# EAGLE design mixer (EAGLE 7.2.0)

## Sheet 1 of 4: IF Filter
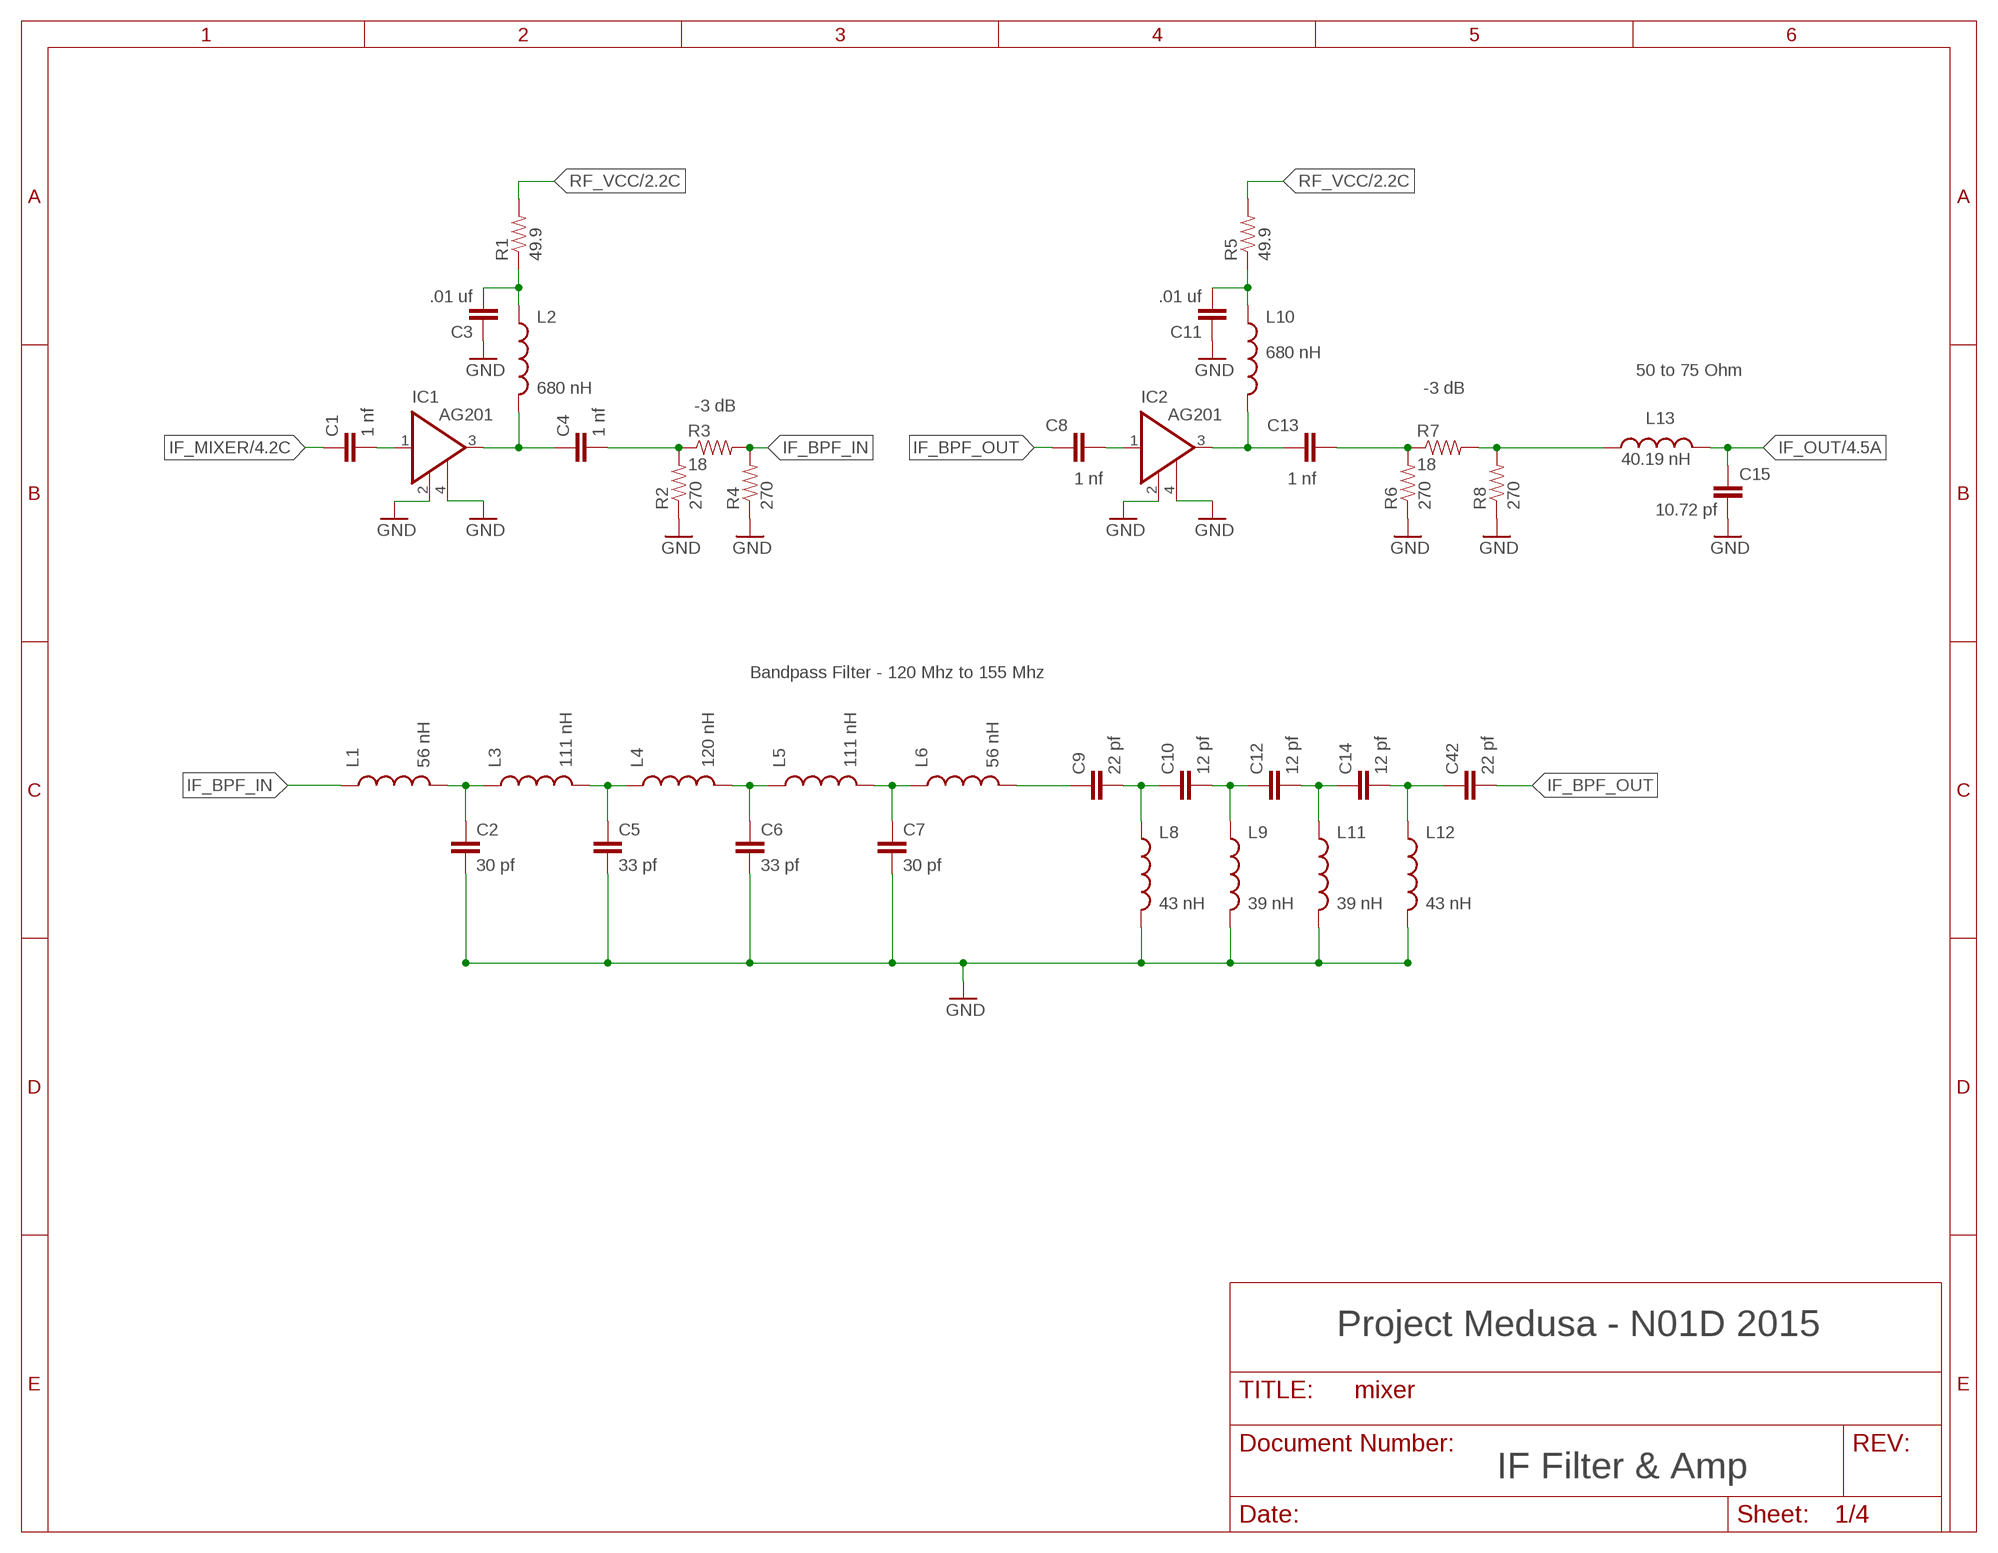
[diagram p0: schematic, sheet 1]

### Parts
C1  1 nf  CAP0805  [0805]
C2  30 pf  CAP0805  [0805]
C3  .01 uf  CAP0805  [0805]
C4  1 nf  CAP0805  [0805]
C5  33 pf  CAP0805  [0805]
C6  33 pf  CAP0805  [0805]
C7  30 pf  CAP0805  [0805]
C8  1 nf  CAP0805  [0805]
C9  22 pf  CAP0805  [0805]
C10  12 pf  CAP0805  [0805]
C11  .01 uf  CAP0805  [0805]
C12  12 pf  CAP0805  [0805]
C13  1 nf  CAP0805  [0805]
C14  12 pf  CAP0805  [0805]
C15  10.72 pf  CAP0805  [0805]
C42  22 pf  CAP0805  [0805]
IC1  AG201  ERA-6SM  [WW]
IC2  AG201  ERA-6SM  [WW]
L1  56 nH  INDUCTORCOILCRAFT-318-2  [318-2]
L2  680 nH  INDUCTOR0805  [0805]
L3  111 nH  INDUCTORCOILCRAFT-319-2  [319-2]
L4  120 nH  INDUCTORCOILCRAFT-318-2  [318-2]
L5  111 nH  INDUCTORCOILCRAFT-319-2  [319-2]
L6  56 nH  INDUCTORCOILCRAFT-318-2  [318-2]
L8  43 nH  INDUCTORCOILCRAFT-457-43NH  [457-43]
L9  39 nH  INDUCTORCOILCRAFT-457-39NH  [457-39]
L10  680 nH  INDUCTOR0805  [0805]
L11  39 nH  INDUCTORCOILCRAFT-457-39NH  [457-39]
L12  43 nH  INDUCTORCOILCRAFT-457-43NH  [457-43]
L13  40.19 nH  INDUCTOR0402  [C0402]
R1  49.9  RESISTOR0805-RES  [0805]
R2  270  RESISTOR1206  [1206]
R3  18  RESISTOR1206  [1206]
R4  270  RESISTOR1206  [1206]
R5  49.9  RESISTOR0805-RES  [0805]
R6  270  RESISTOR1206  [1206]
R7  18  RESISTOR1206  [1206]
R8  270  RESISTOR1206  [1206]

### Nets
GND: C2.2 C3.1 C5.2 C6.2 C7.2 C11.1 C15.1 IC1.2(GND) IC1.4(GND) IC2.2(GND) IC2.4(GND) L8.P$2 L9.P$2 L11.P$2 L12.P$2 R2.1 R4.1 R6.1 R8.1 ; also sheet 2,3,4
IF_BPF_IN: L1.P$1 R3.2 R4.2
IF_BPF_OUT: C8.1 C42.2
IF_MIXER: C1.1 ; also sheet 4
IF_OUT: C15.2 L13.2 ; also sheet 4
N$1: C2.1 L1.P$2 L3.P$1
N$2: C5.1 L3.P$2 L4.P$1
N$3: C6.1 L4.P$2 L5.P$1
N$4: C7.1 L5.P$2 L6.P$1
N$5: C9.1 L6.P$2
N$6: C9.2 C10.1 L8.P$1
N$7: C10.2 C12.1 L9.P$1
N$8: C12.2 C14.1 L11.P$1
N$9: C1.2 IC1.1(RFIN)
N$10: C4.1 IC1.3(RFOUT/DCIN) L2.2
N$11: C3.2 L2.1 R1.1
N$12: C4.2 R2.2 R3.1
N$14: C8.2 IC2.1(RFIN)
N$15: C13.1 IC2.3(RFOUT/DCIN) L10.2
N$16: C11.2 L10.1 R5.1
N$17: C13.2 R6.2 R7.1
N$18: L13.1 R7.2 R8.2
N$49: C14.2 C42.1 L12.P$1
RF_VCC: R1.2 R5.2 ; also sheet 2,3,4

### Notes on the sheet
- 50 to 75 Ohm
- -3 dB
- -3 dB
- Bandpass Filter - 120 Mhz to 155 Mhz
- Project Medusa - N01D 2015
- IF Filter & Amp

## Sheet 2 of 4: RF Filter
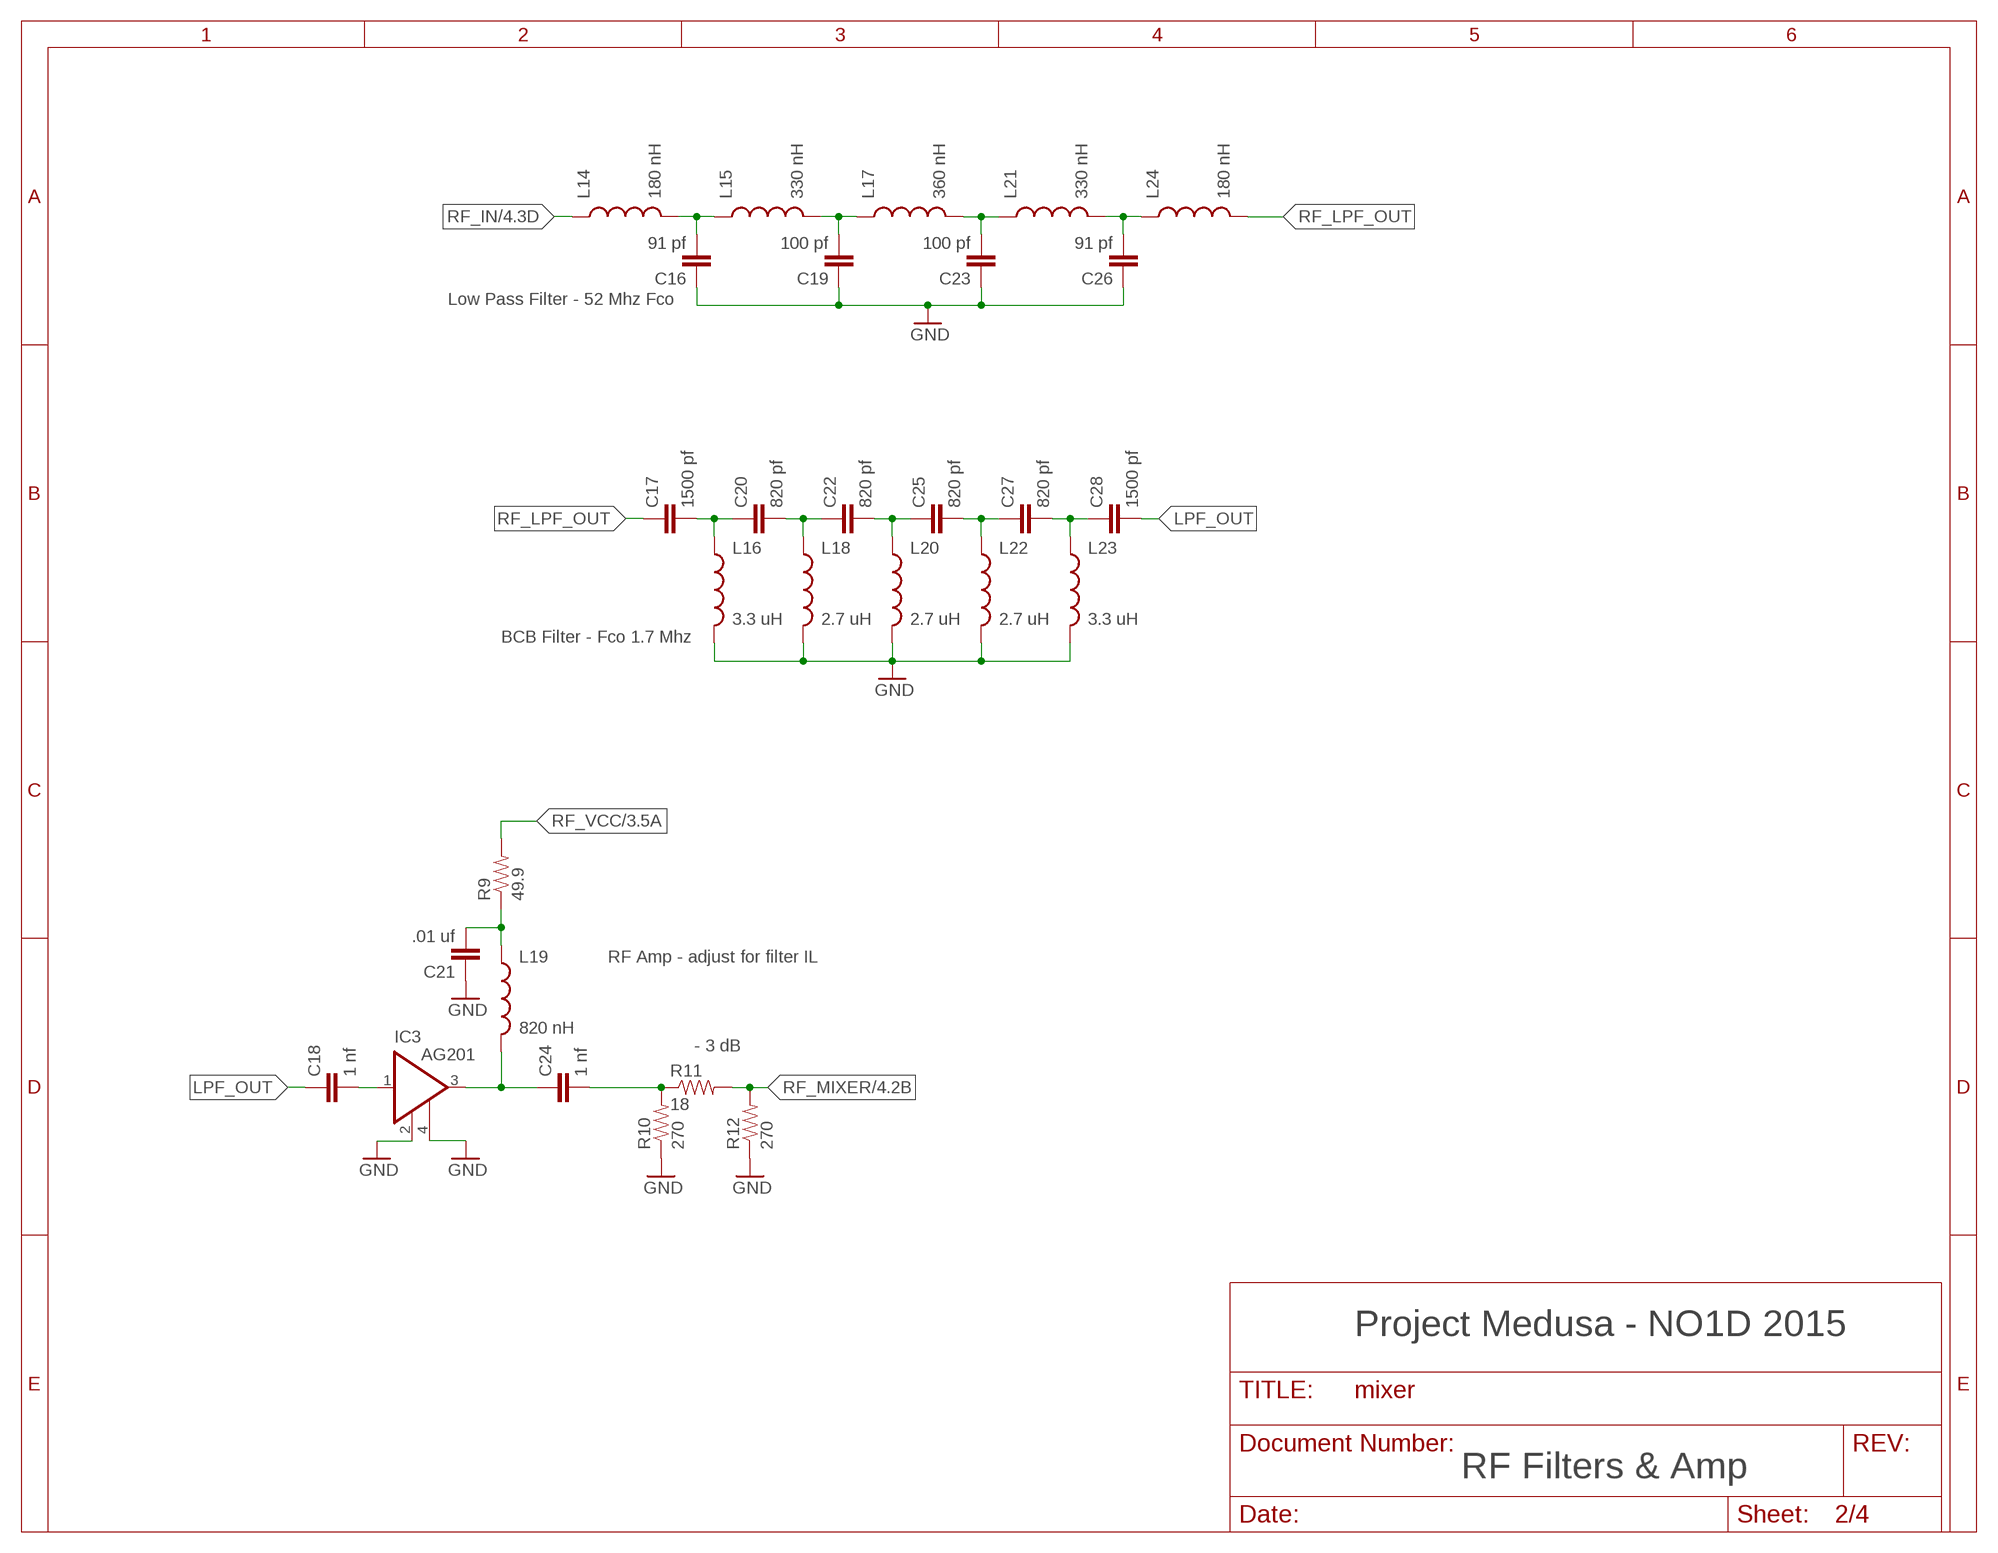
[diagram p1: schematic, sheet 2]

### Parts
C16  91 pf  CAP0805  [0805]
C17  1500 pf  CAP0805  [0805]
C18  1 nf  CAP0805  [0805]
C19  100 pf  CAP0805  [0805]
C20  820 pf  CAP0805  [0805]
C21  .01 uf  CAP0805  [0805]
C22  820 pf  CAP0805  [0805]
C23  100 pf  CAP0805  [0805]
C24  1 nf  CAP0805  [0805]
C25  820 pf  CAP0805  [0805]
C26  91 pf  CAP0805  [0805]
C27  820 pf  CAP0805  [0805]
C28  1500 pf  CAP0805  [0805]
IC3  AG201  ERA-6SM  [WW]
L14  180 nH  INDUCTORCOILCRAFT-438-2-180  [438-2-180]
L15  330 nH  INDUCTORCOILCRAFT-438-2-330  [438-2-330]
L16  3.3 uH  INDUCTORRLB0912  [RLB0912]
L17  360 nH  INDUCTORCOILCRAFT-438-2-360  [438-2-360]
L18  2.7 uH  INDUCTORRLB0912  [RLB0912]
L19  820 nH  INDUCTOR0805  [0805]
L20  2.7 uH  INDUCTORRLB0912  [RLB0912]
L21  330 nH  INDUCTORCOILCRAFT-438-2-330  [438-2-330]
L22  2.7 uH  INDUCTORRLB0912  [RLB0912]
L23  3.3 uH  INDUCTORRLB0912  [RLB0912]
L24  180 nH  INDUCTORCOILCRAFT-438-2-180  [438-2-180]
R9  49.9  RESISTOR0805-RES  [0805]
R10  270  RESISTOR1206  [1206]
R11  18  RESISTOR1206  [1206]
R12  270  RESISTOR1206  [1206]

### Nets
GND: C16.1 C19.1 C21.1 C23.1 C26.1 IC3.2(GND) IC3.4(GND) L16.2 L18.2 L20.2 L22.2 L23.2 R10.1 R12.1 ; also sheet 1,3,4
LPF_OUT: C18.1 C28.2
N$13: C18.2 IC3.1(RFIN)
N$19: C24.1 IC3.3(RFOUT/DCIN) L19.2
N$20: C21.2 L19.1 R9.1
N$21: C24.2 R10.2 R11.1
N$23: C16.2 L14.P$2 L15.P$1
N$24: C19.2 L15.P$2 L17.P$1
N$25: C23.2 L17.P$2 L21.P$1
N$26: C26.2 L21.P$2 L24.P$1
N$28: C17.2 C20.1 L16.1
N$29: C20.2 C22.1 L18.1
N$30: C22.2 C25.1 L20.1
N$31: C25.2 C27.1 L22.1
N$32: C27.2 C28.1 L23.1
RF_IN: L14.P$1 ; also sheet 4
RF_LPF_OUT: C17.1 L24.P$2
RF_MIXER: R11.2 R12.2 ; also sheet 4
RF_VCC: R9.2 ; also sheet 1,3,4

### Notes on the sheet
- Low Pass Filter - 52 Mhz Fco
- BCB Filter - Fco 1.7 Mhz
- RF Amp - adjust for filter IL
- - 3 dB
- Project Medusa - NO1D 2015
- RF Filters & Amp

## Sheet 3 of 4: LO Filter
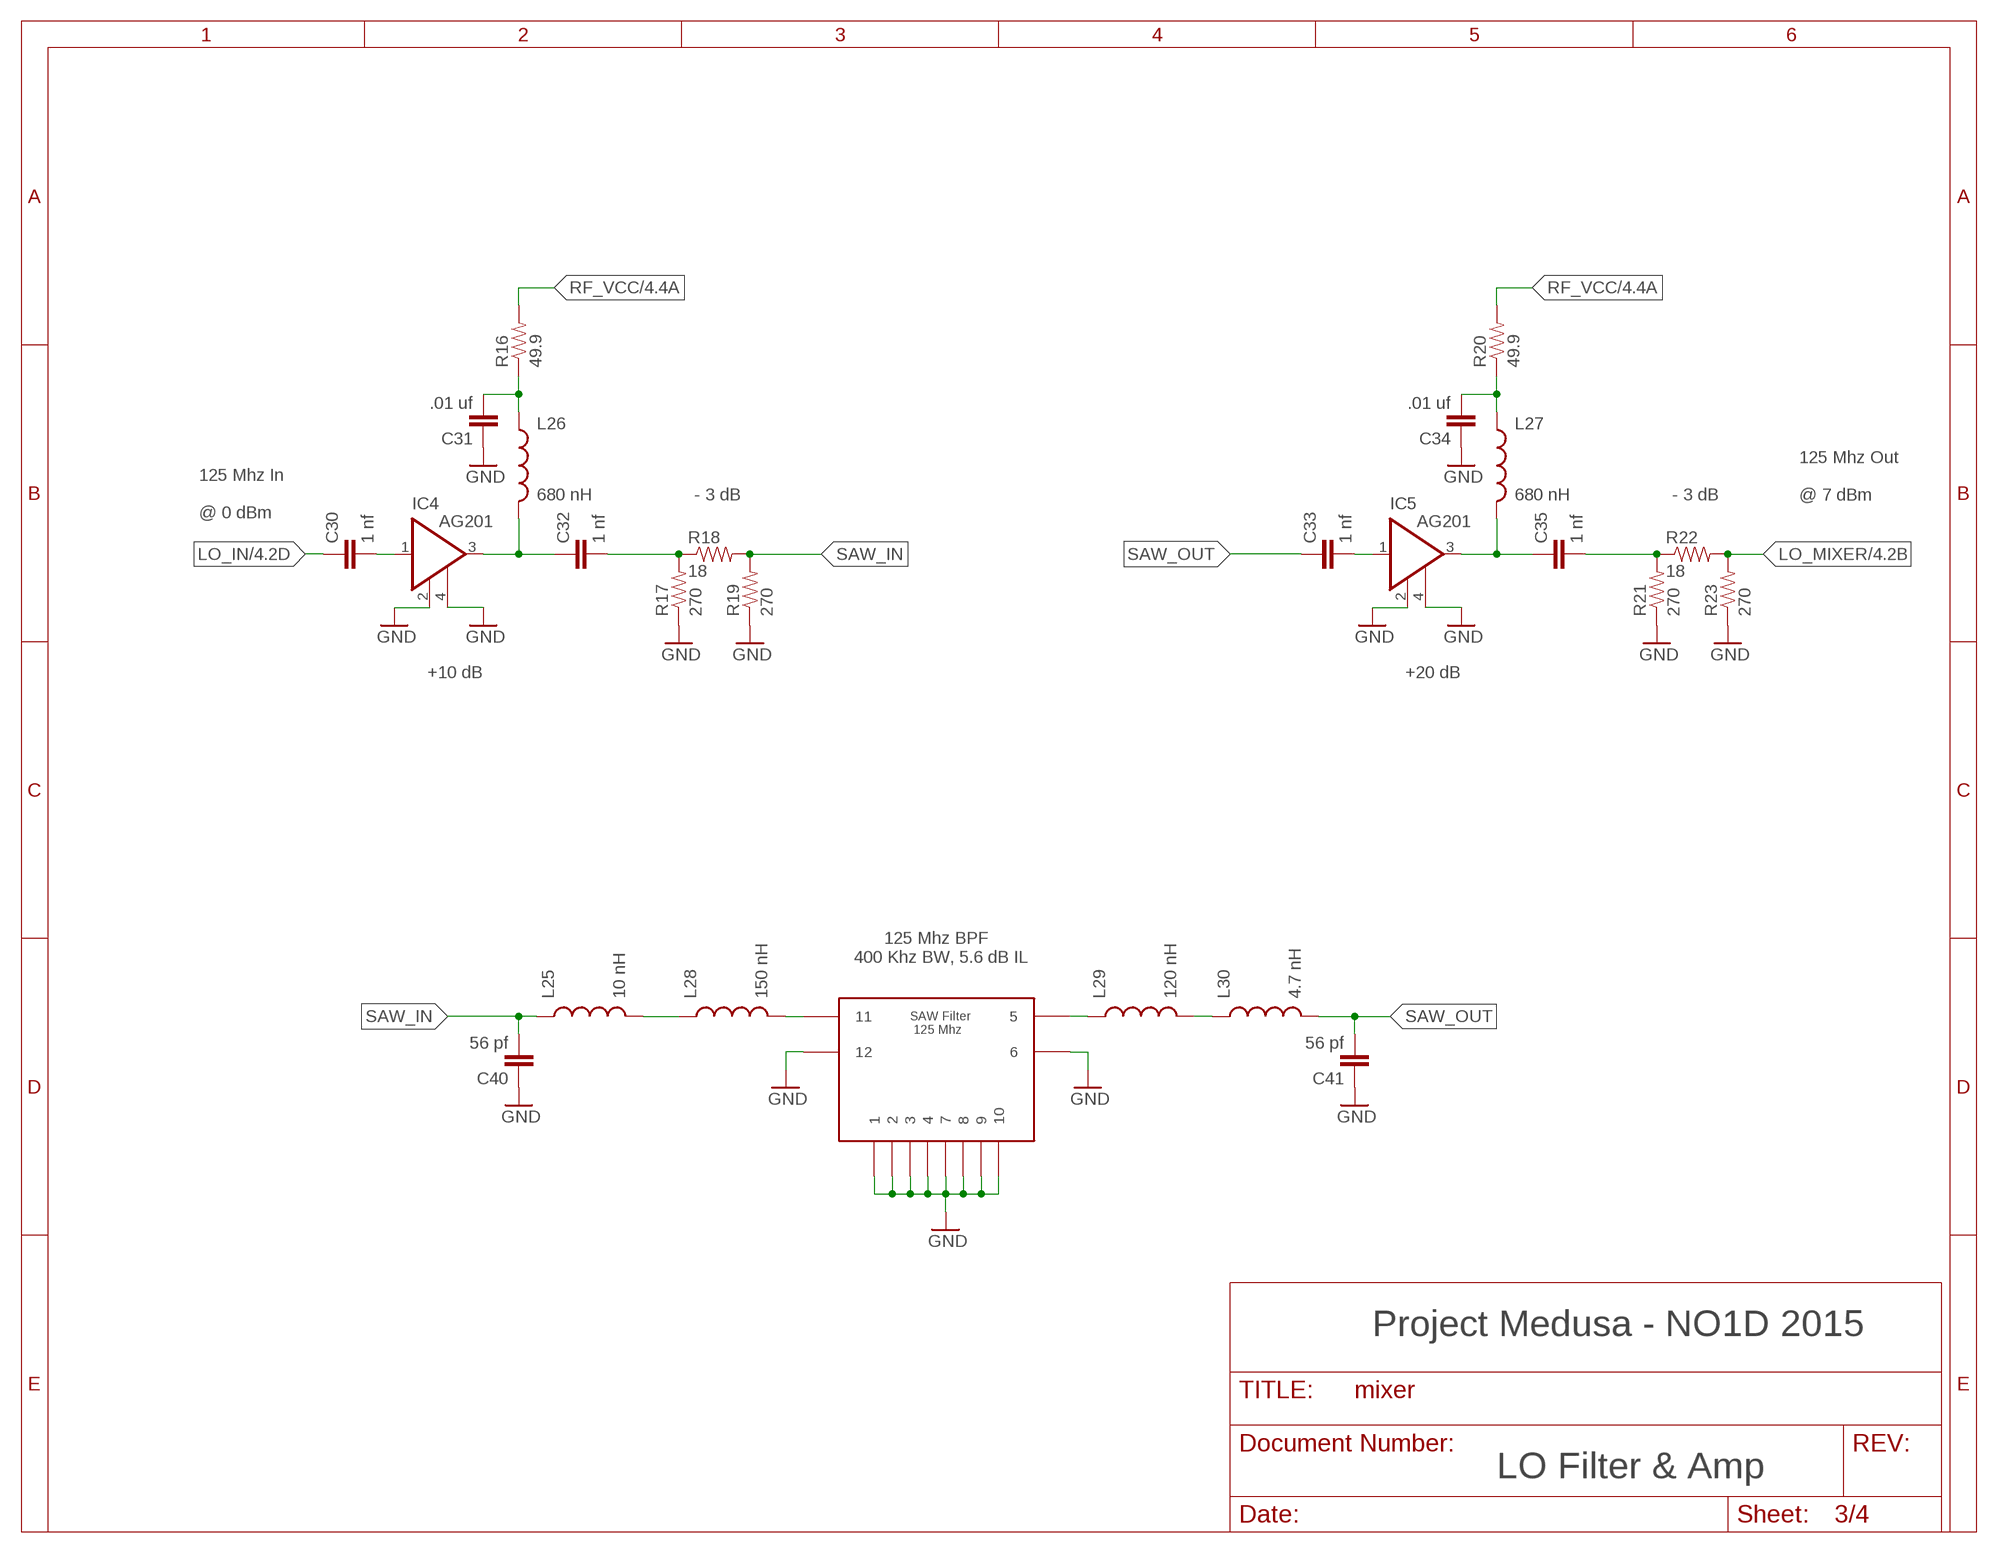
[diagram p2: schematic, sheet 3]

### Parts
C30  1 nf  CAP0805  [0805]
C31  .01 uf  CAP0805  [0805]
C32  1 nf  CAP0805  [0805]
C33  1 nf  CAP0805  [0805]
C34  .01 uf  CAP0805  [0805]
C35  1 nf  CAP0805  [0805]
C40  56 pf  CAP0805  [0805]
C41  56 pf  CAP0805  [0805]
IC4  AG201  ERA-6SM  [WW]
IC5  AG201  ERA-6SM  [WW]
L25  10 nH  INDUCTOR0402  [C0402]
L26  680 nH  INDUCTOR0805  [0805]
L27  680 nH  INDUCTOR0805  [0805]
L28  150 nH  INDUCTOR0805  [0805]
L29  120 nH  INDUCTOR0805  [0805]
L30  4.7 nH  INDUCTOR0402  [C0402]
R16  49.9  RESISTOR0805-RES  [0805]
R17  270  RESISTOR1206  [1206]
R18  18  RESISTOR1206  [1206]
R19  270  RESISTOR1206  [1206]
R20  49.9  RESISTOR0805-RES  [0805]
R21  270  RESISTOR1206  [1206]
R22  18  RESISTOR1206  [1206]
R23  270  RESISTOR1206  [1206]
SAW1  SAW-125MHZ  [SAW-125M-SMP]

### Nets
GND: C31.1 C34.1 C40.1 C41.1 IC4.2(GND) IC4.4(GND) IC5.2(GND) IC5.4(GND) R17.1 R19.1 R21.1 R23.1 SAW1.P$1 SAW1.P$2 SAW1.P$3 SAW1.P$4 SAW1.P$6 SAW1.P$7 SAW1.P$8 SAW1.P$9 SAW1.P$10 SAW1.P$12 ; also sheet 1,2,4
LO_IN: C30.1 ; also sheet 4
LO_MIXER: R22.2 R23.2 ; also sheet 4
N$22: C30.2 IC4.1(RFIN)
N$33: C32.1 IC4.3(RFOUT/DCIN) L26.2
N$34: C31.2 L26.1 R16.1
N$35: C32.2 R17.2 R18.1
N$36: C33.2 IC5.1(RFIN)
N$37: C35.1 IC5.3(RFOUT/DCIN) L27.2
N$38: C34.2 L27.1 R20.1
N$39: C35.2 R21.2 R22.1
N$45: L25.2 L28.1
N$46: L29.2 L30.1
N$47: L28.2 SAW1.P$11
N$48: L29.1 SAW1.P$5
RF_VCC: R16.2 R20.2 ; also sheet 1,2,4
SAW_IN: C40.2 L25.1 R18.2 R19.2
SAW_OUT: C33.1 C41.2 L30.2

### Notes on the sheet
- - 3 dB | - 3 dB
- 125 Mhz Out
  
  @ 7 dBm
- 125 Mhz In
  
  @ 0 dBm
- +10 dB | +20 dB
- 125 Mhz BPF 
     400 Khz BW, 5.6 dB IL
- Project Medusa - NO1D 2015
- LO Filter & Amp

## Sheet 4 of 4: Mixer, Power, Connectors
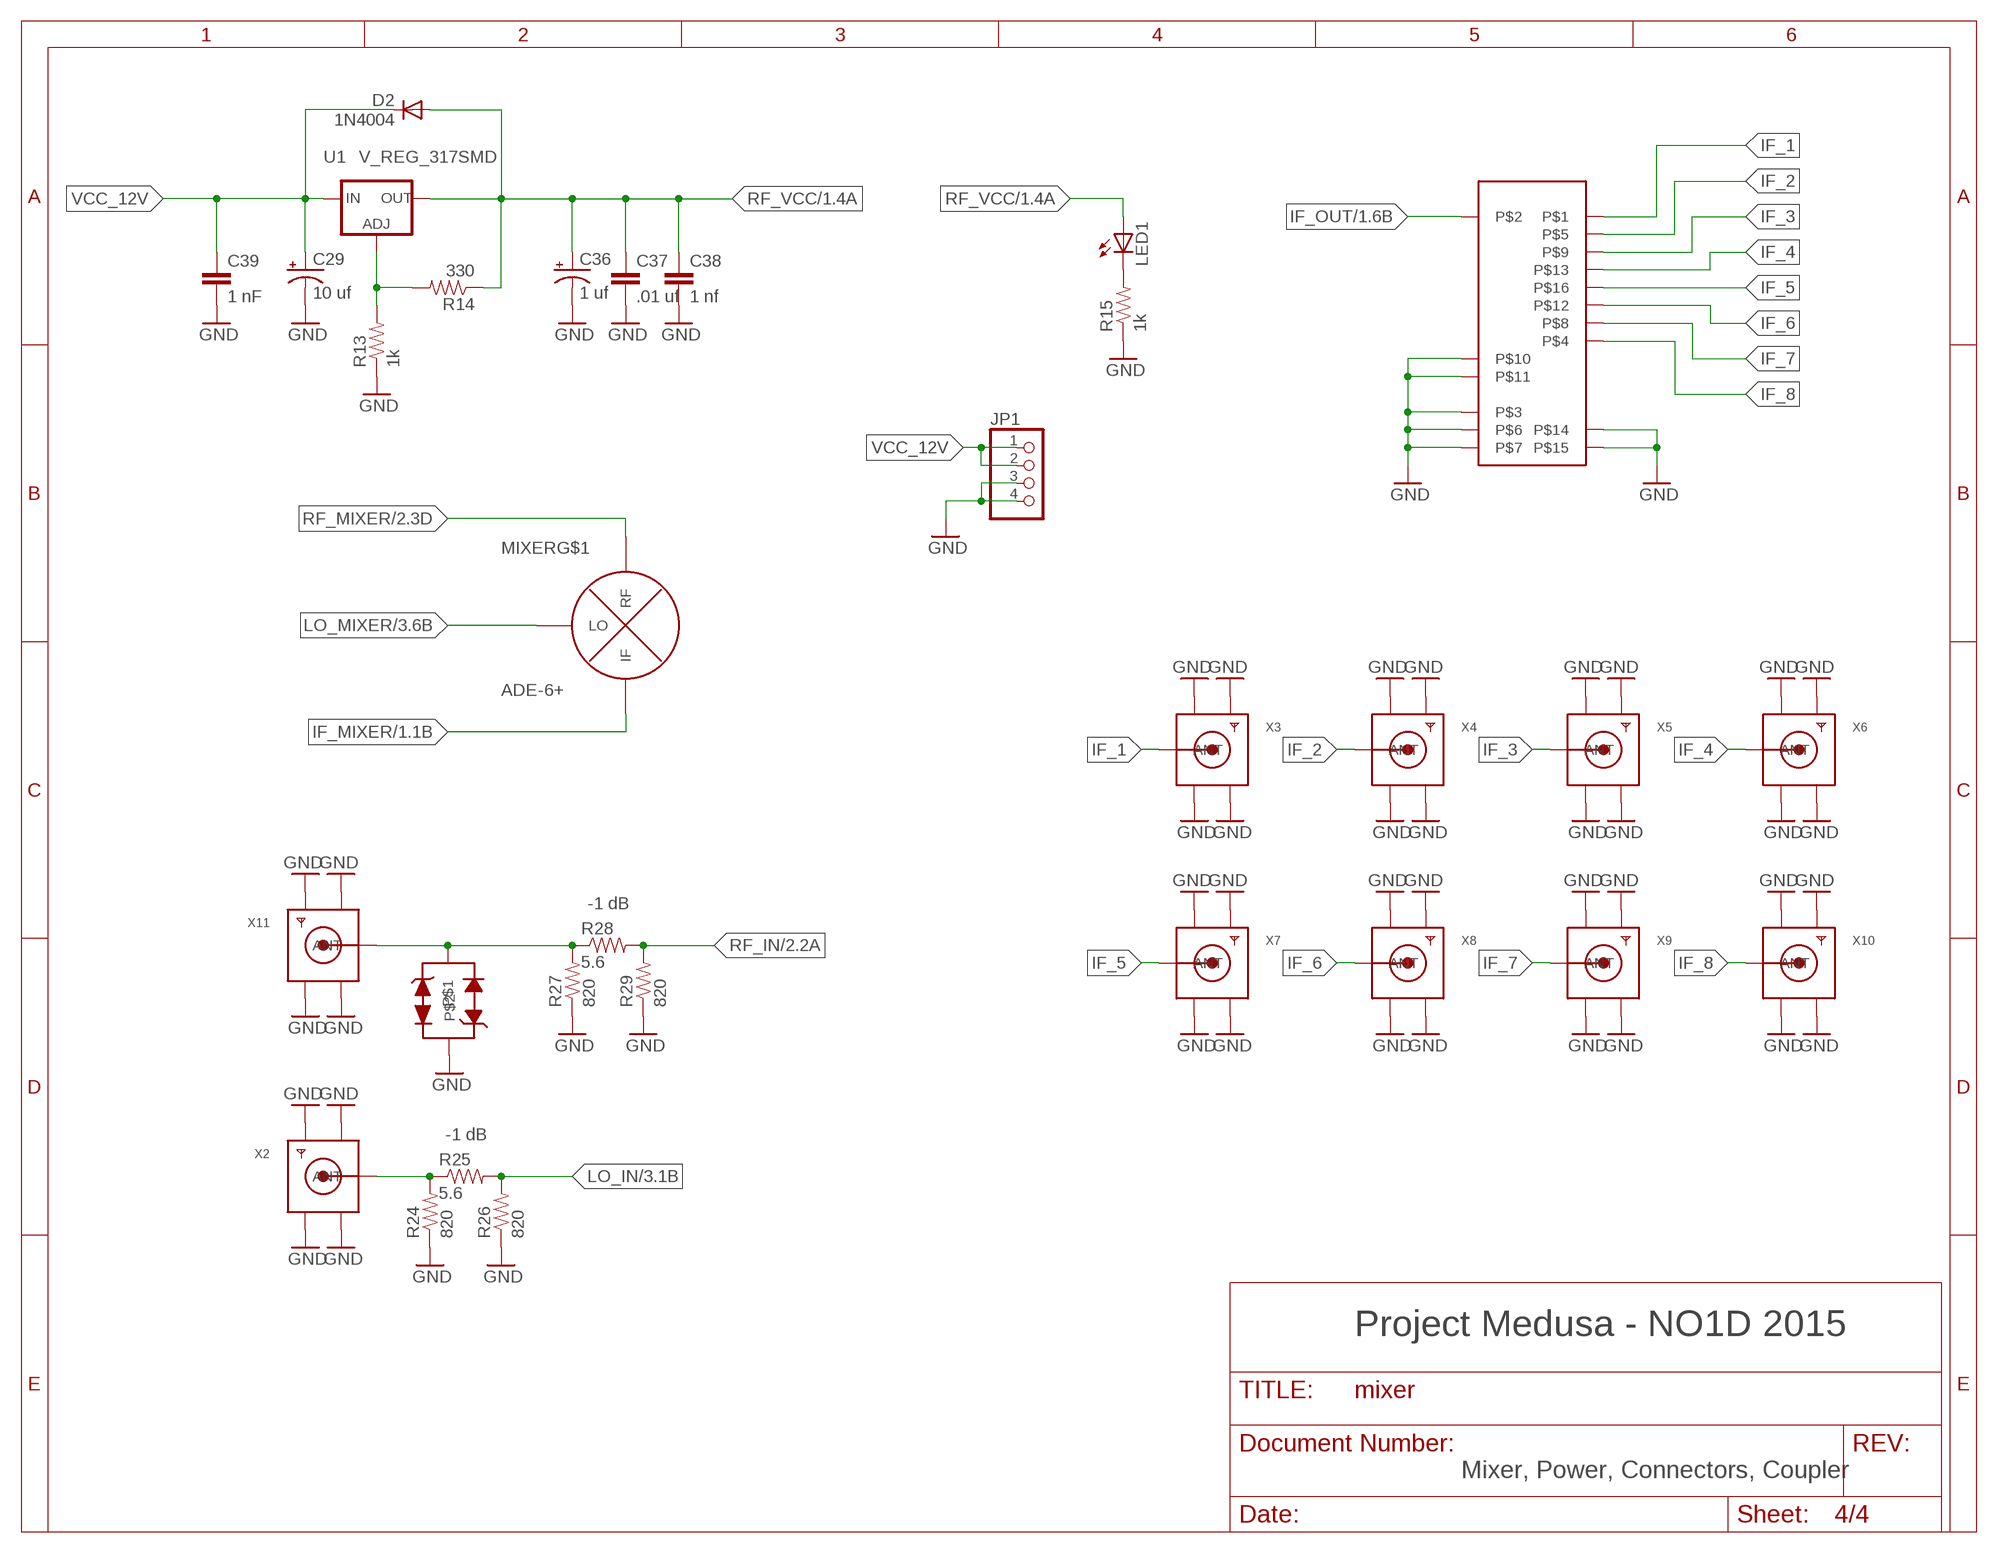
[diagram p3: schematic, sheet 4]

### Parts
C29  10 uf  CAP_POL1206  [EIA3216]
C36  1 uf  CAP_POL1206  [EIA3216]
C37  .01 uf  CAP0805  [0805]
C38  1 nf  CAP0805  [0805]
C39  1 nF  CAP0805  [0805]
D2  1N4004  [DO41-10]
JP1  PINHD-1X4  [1X04]
LED1  LEDSML0805  [SML0805]
MIXER  ADE-6+  ADE-6  [ADE6]
R13  1k  RESISTOR1206  [1206]
R14  330  RESISTOR1206  [1206]
R15  1k  RESISTOR1206  [1206]
R24  820  RESISTOR1206  [1206]
R25  5.6  RESISTOR1206  [1206]
R26  820  RESISTOR1206  [1206]
R27  820  RESISTOR1206  [1206]
R28  5.6  RESISTOR1206  [1206]
R29  820  RESISTOR1206  [1206]
U1  V_REG_317SMD  [SOT223]
U$1  PSC-8-1-75THROUGH_HOLE  [PSC-8-1-75]
U$9  TVS-DIODE  [SOD323]
X2  SMACONNECTOR_EDGE  [SMA_EDGELAUNCH]
X3  SMACONNECTOR_EDGE  [SMA_EDGELAUNCH]
X4  SMACONNECTOR_EDGE  [SMA_EDGELAUNCH]
X5  SMACONNECTOR_EDGE  [SMA_EDGELAUNCH]
X6  SMACONNECTOR_EDGE  [SMA_EDGELAUNCH]
X7  SMACONNECTOR_EDGE  [SMA_EDGELAUNCH]
X8  SMACONNECTOR_EDGE  [SMA_EDGELAUNCH]
X9  SMACONNECTOR_EDGE  [SMA_EDGELAUNCH]
X10  SMACONNECTOR_EDGE  [SMA_EDGELAUNCH]
X11  SMACONNECTOR_EDGE  [SMA_EDGELAUNCH]

### Nets
GND: C29.C(-) C36.C(-) C37.2 C38.2 C39.2 JP1.3 JP1.4 R13.1 R15.1 R24.1 R26.1 R27.1 R29.1 U$1.P$3 U$1.P$6 U$1.P$7 U$1.P$10 U$1.P$11 U$1.P$14 U$1.P$15 U$9.P$3 X2.GND@1(GND4) X2.GND@2(GND3) X2.GND@3(GND2) X2.GND@4(GND1) X3.GND@1(GND4) X3.GND@2(GND3) X3.GND@3(GND2) X3.GND@4(GND1) X4.GND@1(GND4) X4.GND@2(GND3) X4.GND@3(GND2) X4.GND@4(GND1) X5.GND@1(GND4) X5.GND@2(GND3) X5.GND@3(GND2) X5.GND@4(GND1) X6.GND@1(GND4) X6.GND@2(GND3) X6.GND@3(GND2) X6.GND@4(GND1) X7.GND@1(GND4) X7.GND@2(GND3) X7.GND@3(GND2) X7.GND@4(GND1) X8.GND@1(GND4) X8.GND@2(GND3) X8.GND@3(GND2) X8.GND@4(GND1) X9.GND@1(GND4) X9.GND@2(GND3) X9.GND@3(GND2) X9.GND@4(GND1) X10.GND@1(GND4) X10.GND@2(GND3) X10.GND@3(GND2) X10.GND@4(GND1) X11.GND@1(GND4) X11.GND@2(GND3) X11.GND@3(GND2) X11.GND@4(GND1) ; also sheet 1,2,3
IF_1: U$1.P$1 X3.P(ANT)
IF_2: U$1.P$5 X4.P(ANT)
IF_3: U$1.P$9 X5.P(ANT)
IF_4: U$1.P$13 X6.P(ANT)
IF_5: U$1.P$16 X7.P(ANT)
IF_6: U$1.P$12 X8.P(ANT)
IF_7: U$1.P$8 X9.P(ANT)
IF_8: U$1.P$4 X10.P(ANT)
IF_MIXER: MIXER.P$2(IF) ; also sheet 1
IF_OUT: U$1.P$2 ; also sheet 1
LO_IN: R25.2 R26.2 ; also sheet 3
LO_MIXER: MIXER.P$6(LO) ; also sheet 3
N$27: R13.2 R14.2 U1.1(ADJ)
N$41: R24.2 R25.1 X2.P(ANT)
N$42: R27.2 R28.1 U$9.P$1 X11.P(ANT)
N$43: LED1.C R15.2
RF_IN: R28.2 R29.2 ; also sheet 2
RF_MIXER: MIXER.P$3(RF) ; also sheet 2
RF_VCC: C36.A(+) C37.1 C38.1 D2.A LED1.A R14.1 U1.2(OUT) ; also sheet 1,2,3
VCC_12V: C29.A(+) C39.1 D2.C JP1.1 JP1.2 U1.3(IN)

### Notes on the sheet
- -1 dB
- -1 dB
- Project Medusa - NO1D 2015
- Mixer, Power, Connectors, Coupler

## Power pins joined to a net without a drawn wire
GND: MIXER.P$1(GND) MIXER.P$4(GND) MIXER.P$5(GND)

## Library data of the parts
C1-C28 C30-C35 C40-C42 = SparkFun-Capacitors:CAP: Capacitor Standard 0603 ceramic capacitor, and 0.1" leaded capacitor.
C29 C36 = SparkFun-Passives:CAP_POL: Capacitor Polarized These are standard SMD and PTH capacitors. Normally 10uF, 47uF, and 100uF in electrolytic and tantalum varieties. Always verify the external diameter of the through hole cap, it varies with capacity, voltage, and manufacturer. The EIA devices should be standard.
C37-C39 = SparkFun-Passives:CAP: Capacitor Standard 0603 ceramic capacitor, and 0.1" leaded capacitor.
D2 = diode:1N4004: DIODE general purpose rectifier, 1 A
IC1-IC5 = linear:ERA-*: MONOLITHIC AMPLIFIERS 50 Ohm BROADBAND DC to 8 GHz Source: Datasheet <http://www.mini-circuits.com/pdfs/ERA-3SM+.pdf>
JP1 = pinhead:PINHD-1X4: PIN HEADER
L1-L6 L8-L30 = SparkFun-Passives:INDUCTOR: Inductors Basic Inductor/Choke - 0603 and 1206. Footprints are not proven and vary greatly between part numbers. SRN6045- 33uH, 20% 1.4A SDR0403-560KL - 56uH, 10%, 500mA RMS/740mA peak
LED1 = led:LED: LED OSRAM: - CHIPLED LG R971, LG N971, LY N971, LG Q971, LY Q971, LO R971, LY R971 LH N974, LH R974 LS Q976, LO Q976, LY Q976 LO Q996 - Hyper CHIPLED LW Q18S LB Q993, LB Q99A, LB R99A - SideLED LS A670, LO A670, LY A670, LG A670, LP A670 LB A673, LV A673, LT A673, LW A673 LH A674 LY A675 LS A676, LA A676, LO A676, LY A676, LW A676 LS A679, LY A679, LG A679 - Hyper Micro SIDELED® LS Y876, LA Y876, LO Y876, LY Y876 LT Y87S - SmartLED LW L88C, LW L88S LB L89C, LB L89S, LG L890 LS L89K, LO L89K, LY L89K LS L896, LA L896, LO L896, LY L896 - TOPLED LS T670, LO T670, LY T670, LG T670, LP T670 LSG T670, LSP T670, LSY T670, LOP T670, LYG T670 LG T671, LOG T671, LSG T671 LB T673, LV T673, LT T673, LW T673 LH T674 LS T676, LA T676, LO T676, LY T676, LB T676, LH T676, LSB T676, LW T676 LB T67C, LV T67C, LT T67C, LS T67K, LO T67K, LY T67K, LW E67C LS E67B, LA E67B, LO E67B, LY E67B, LB E67C, LV E67C, LT E67C LW T67C LS T679, LY T679, LG T679 LS T770, LO T770, LY T770, LG T770, LP T770 LB T773, LV T773, LT T773, LW T773 LH T774 LS E675, LA E675, LY E675, LS T675 LS T776, LA T776, LO T776, LY T776, LB T776 LHGB T686 LT T68C, LB T68C - Hyper Mini TOPLED® LB M676 - Mini TOPLED Santana® LG M470 LS M47K, LO M47K, LY M47K Source: http://www.osram.convergy.de LUXEON: - LUMILED® LXK2-PW12-R00, LXK2-PW12-S00, LXK2-PW14-U00, LXK2-PW14-V00 LXK2-PM12-R00, LXK2-PM12-S00, LXK2-PM14-U00 LXK2-PE12-Q00, LXK2-PE12-R00, LXK2-PE12-S00, LXK2-PE14-T00, LXK2-PE14-U00 LXK2-PB12-K00, LXK2-PB12-L00, LXK2-PB12-M00, LXK2-PB14-N00, LXK2-PB14-P00, LXK2-PB14-Q00 LXK2-PR12-L00, LXK2-PR12-M00, LXK2-PR14-Q00, LXK2-PR14-R00 LXK2-PD12-Q00, LXK2-PD12-R00, LXK2-PD12-S00 LXK2-PH12-R00, LXK2-PH12-S00 LXK2-PL12-P00, LXK2-PL12-Q00, LXK2-PL12-R00 Source: www.luxeon.com KINGBRIGHT: KA-3528ASYC Source: www.kingbright.com
MIXER = minicircuits-1-dt:ADE-6
R1-R29 = SparkFun-Resistors:RESISTOR: Resistor Basic schematic elements and footprints for 0603, 1206, and PTH resistors.
SAW1 = triquint-dt:SAW-125MHZ
U1 = SparkFun-PowerIC:V_REG_317: Voltage Regulator Standard LM317 adjustable voltage regulator. AOI (Adjust Output Input). Google 'LM317 Calculator' for easy to use app to get the two resistor values needed. 240/720 for 5V output. 240/390 for 3.3V output. Spark Fun Electronics SKU : COM-00527
U$1 = minicir-dt:PSC-8-1-75
U$9 = dt-passives:TVS-DIODE
X2-X11 = adafruit:SMACONNECTOR: SMA Connector 90° DIP SMA Connector, 50 Ohm (4UConnector: 07259)

## Board
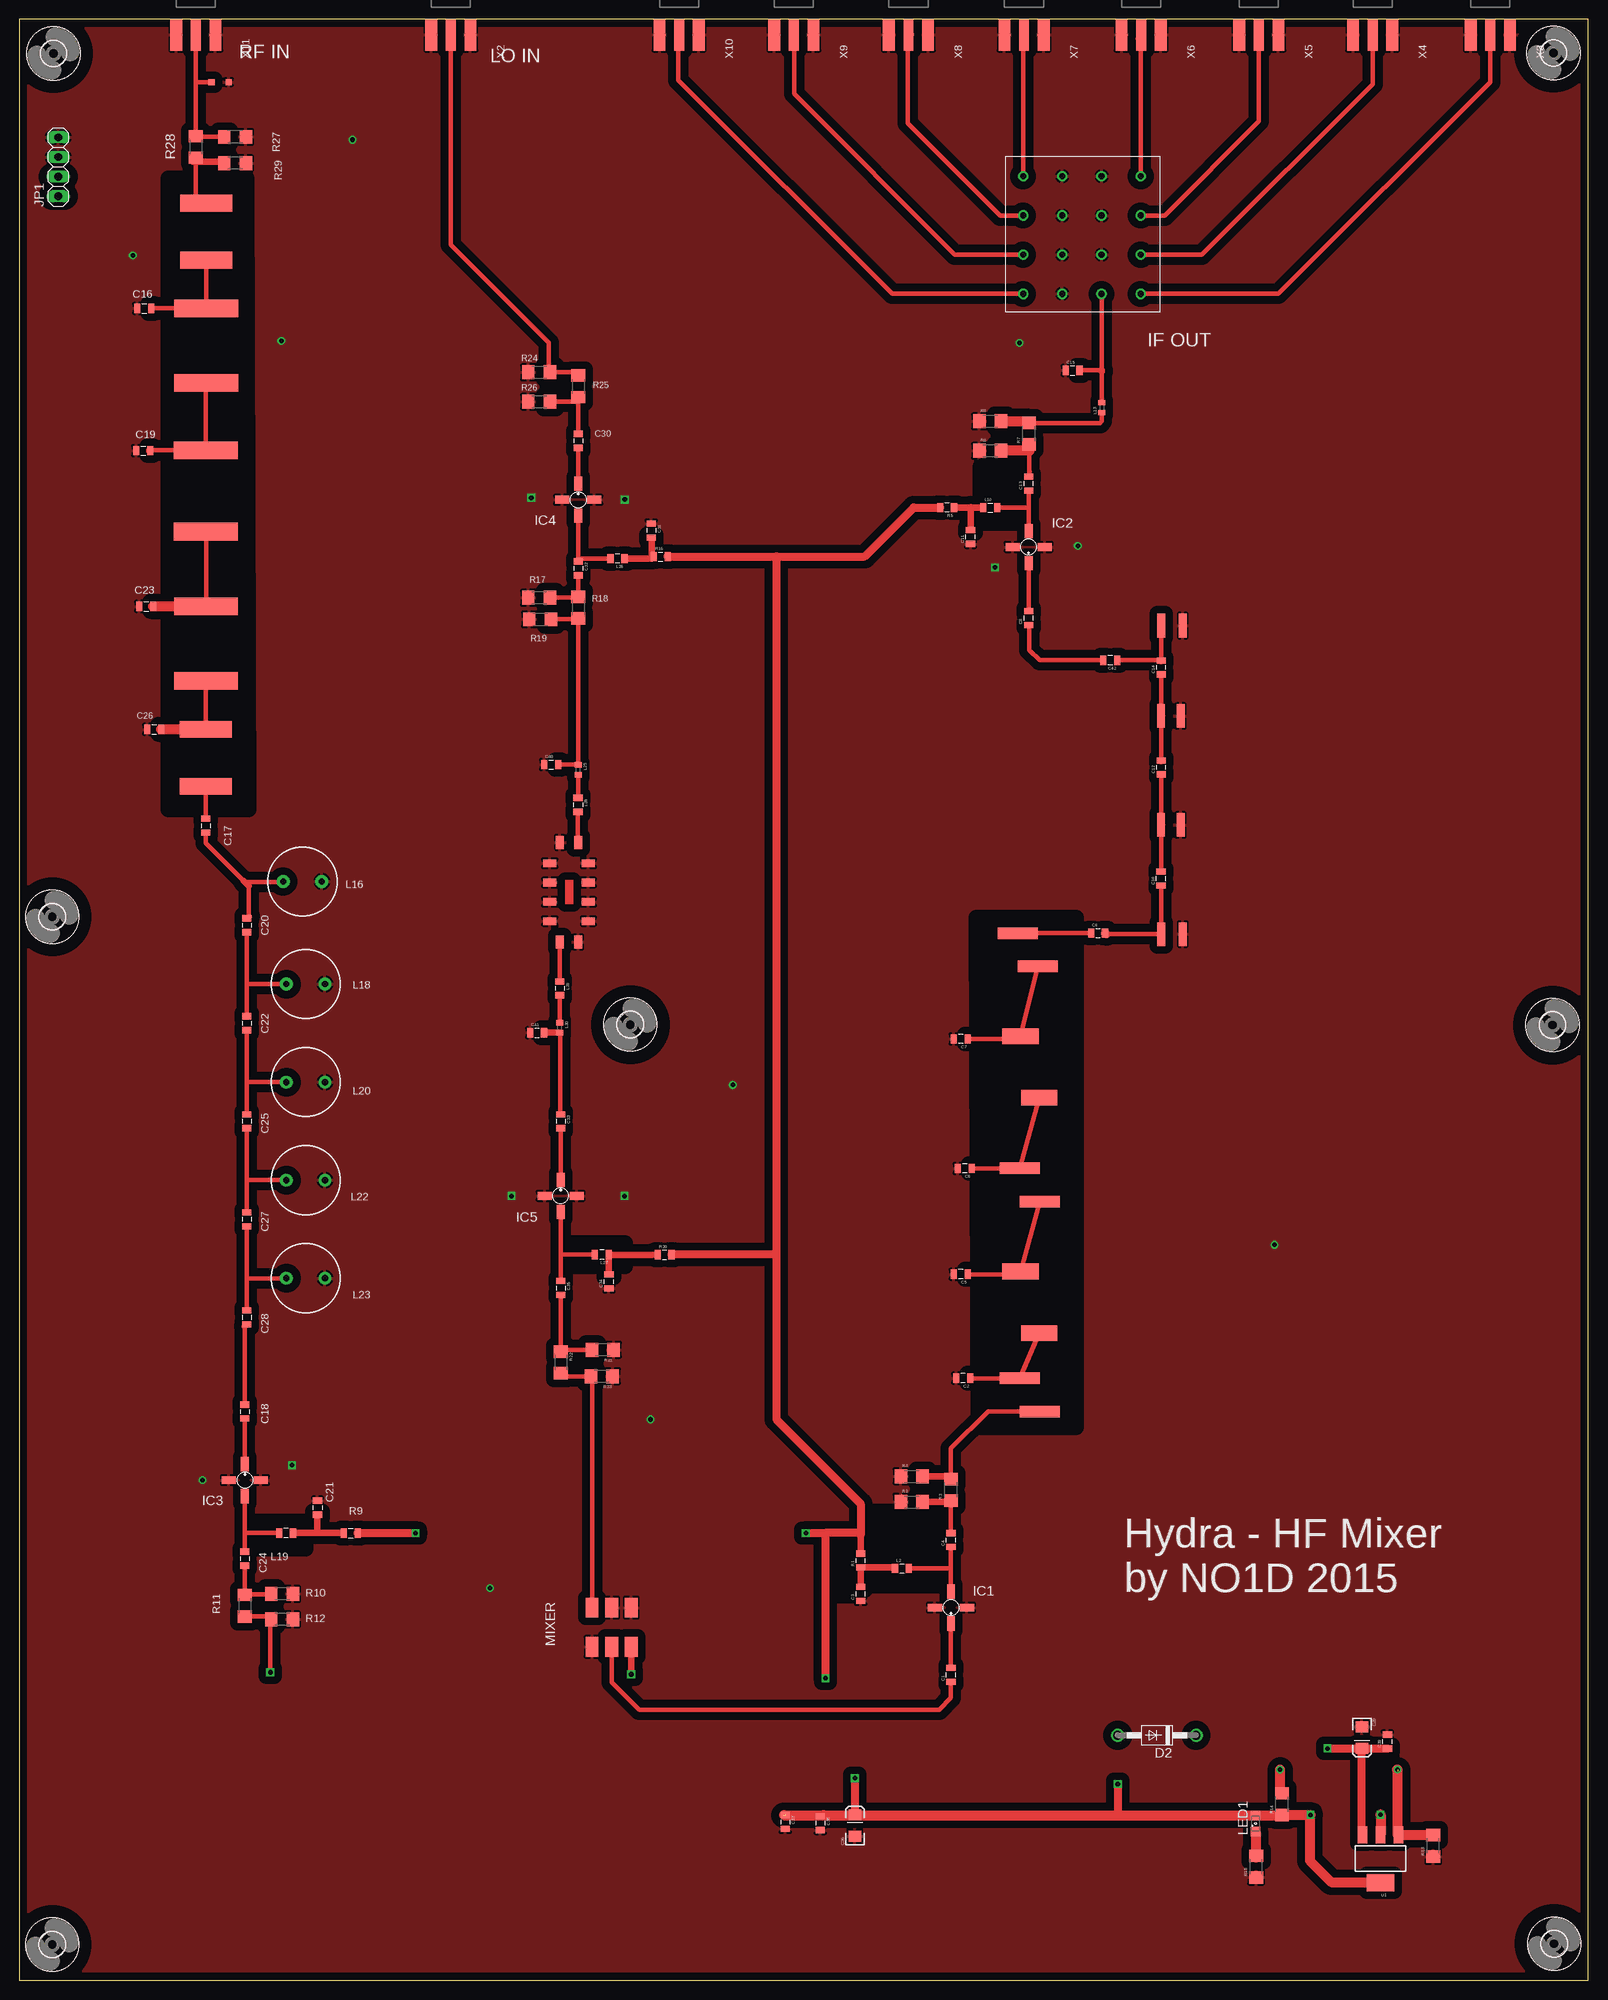
[diagram p4: board, top side]
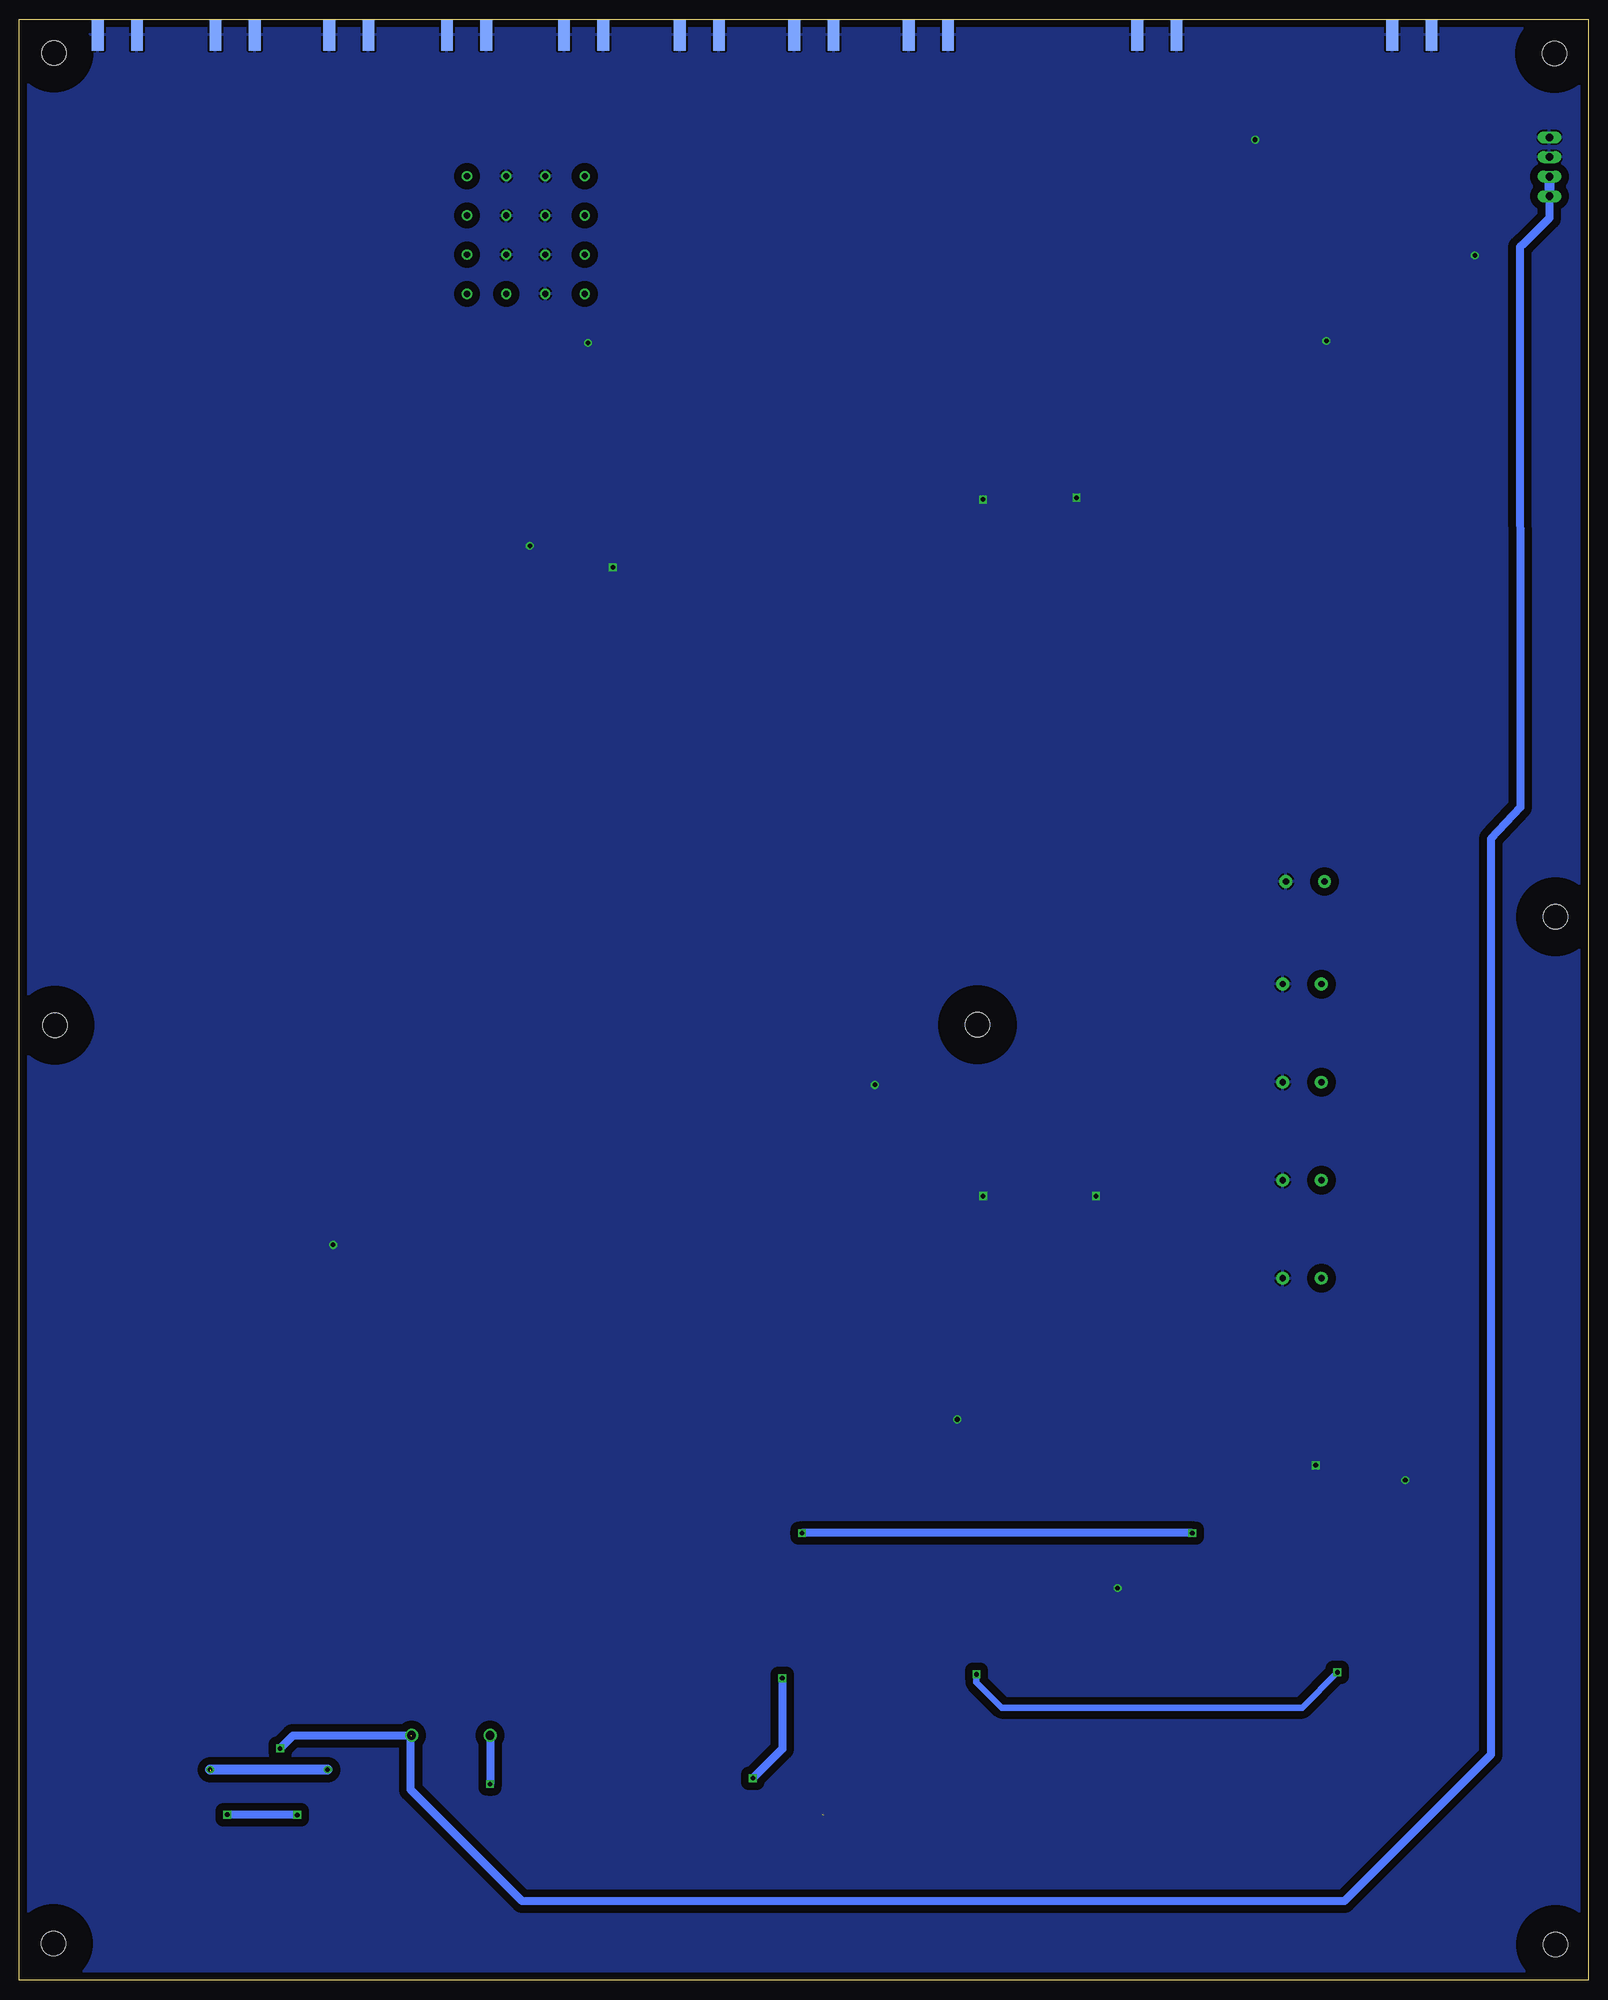
[diagram p5: board, bottom side, seen from below]

Size 203.2 x 254 mm. Coordinates in mm from the lower left corner, seen from the top.
Outline: 0,0 203.18,0 203.2,254 0,254 0,0
Copper layers (1*16): Top 0.035mm / dielectric 1.5mm / Bottom 0.035mm
Design rules "default *": minimum track width 10mil, minimum drill 24mil, track to track 8mil, track to pad 8mil, pad to pad 8mil, via to via 8mil, smd to smd 8mil, copper to edge 40mil, drill to drill 8mil, minimum pad ring 10mil, minimum via ring 8mil, stop-mask expansion 4mil, vias tented up to drill 0mil, thermal gap 10mil
tRestrict: area 124.5,192.3 to 129.5,196.1; area 125.2,188.7 to 129.3,189.5; area 124,71.6 to 136.9,137.7; area 110.2,51.1 to 119.4,60.7; area 105.4,49.8 to 108,56.4; area 71.4,92.5 to 78.5,95.5; area 30.5,55.9 to 37.1,59.4; area 19.3,151.6 to 29.7,233.4

### Footprints (pad centres in the part's own frame; a part is rotated, then mirrored left to right if it is on the bottom)
0805 = smd 0.8 x 1.2: 1 -0.9,0; 2 0.9,0
EIA3216 = smd 1.4 x 1.6: A 1.4,0; C -1.4,0
DO41-10 = drill 1.118: A 5.08,0; C -5.08,0
WW = smd 1.02 x 1.83: 1 0,-2.075; 3 0,2.075 | smd 1.83 x 1.02: 2 2.075,0; 4 -2.075,0
1X04 = drill 1.016 long: 1 -3.81,0; 2 -1.27,0; 3 1.27,0; 4 3.81,0
318-2 = smd 1.48 x 5.16: P$1 -4.32,-2.62; P$2 0,0
319-2 = smd 2.04 x 4.7: P$1 0,0; P$2 -7.98,-2.41
457-43 = smd 1.02 x 3.05: P$1 0,0; P$2 2.79,0
457-39 = smd 1.02 x 3.05: P$1 0,0; P$2 2.54,0
C0402 = smd 0.7 x 0.9: 1 -0.65,0; 2 0.65,0
438-2-180 = smd 2.16 x 6.73: P$1 0,-0.254; P$2 7.366,-0.254
438-2-330 = smd 2.29 x 8.26: P$1 0,0; P$2 9.652,0
RLB0912 = drill 0.813 pad 1.651: 1 2.502,0; 2 -2.502,0
438-2-360 = smd 2.29 x 8.26: P$1 0,0; P$2 10.54,0
SML0805 = smd 1.2 x 1.2: A 1.05,0; C -1.05,0
ADE6 = smd 1.651 x 2.54: P$1 0,0; P$2 2.54,0; P$3 5.08,0; P$4 5.08,5.08; P$5 2.54,5.08; P$6 0,5.08
1206 = smd 1.6 x 1.8: 1 -1.4,0; 2 1.4,0
SAW-125M-SMP = smd 0.99 x 1.7: P$1 1.6,1; P$2 4.1,1; P$3 6.6,1; P$4 9.1,1; P$7 9.1,6; P$8 6.6,6; P$9 4.1,6; P$10 1.6,6 | smd 1.7 x 0.99: P$5 11.8,2.3; P$6 11.8,4.7; P$11 -1.1,4.7; P$12 -1.1,2.3
SOT223 = smd 1.219 x 2.235: 1 -2.311,-3.099; 2 0,-3.099; 3 2.311,-3.099 | smd 3.6 x 2.2: 4 0,3.099
PSC-8-1-75 = drill 0.8: P$1 2.55,17.79; P$2 7.63,17.79; P$3 12.71,17.79; P$4 17.79,17.79; P$5 2.55,12.71; P$6 7.63,12.71; P$7 12.71,12.71; P$8 17.79,12.71; P$9 2.55,7.63; P$10 7.63,7.63; P$11 12.71,7.63; P$12 17.79,7.63; P$13 2.55,2.55; P$14 7.63,2.55; P$15 12.71,2.55; P$16 17.79,2.55
3,2 = hole 3.2: 0,0
SOD323 = smd 0.787 x 0.787: P$1 0,0; P$3 2.235,0
SMA_EDGELAUNCH = smd 4.064 x 1.524: GND@1 2.032,-2.54; GND@2 2.032,2.54 | smd 4.064 x 1.524 bottom: GND@3 2.032,2.54; GND@4 2.032,-2.54 | smd 4.064 x 1.27: P 2.032,0

### Placement (x,y rotation side)
C1  120.65,39.55 90 top
C2  122.23,77.98 180 top
C3  108.97,50.04 90 top
C4  120.65,57.02 90 top
C5  121.92,91.44 180 top
C6  122.43,105.16 180 top
C7  121.92,121.92 180 top
C8  130.71,176.43 90 top
C9  139.7,135.64 0 top
C10  147.85,142.7 90 top
C11  123.19,186.94 90 top
C12  147.88,157.1 90 top
C13  130.71,193.85 90 top
C14  147.88,170.05 90 top
C15  136.4,208.53 0 top
C16  16.18,216.56 0 top
C17  24.16,149.56 270 top
C18  29.21,73.66 270 top
C19  16.05,198.12 0 top
C20  29.46,136.65 270 top
C21  38.61,61.21 270 top
C22  29.46,123.95 270 top
C23  16.43,177.95 0 top
C24  29.21,54.61 270 top
C25  29.46,111.25 270 top
C26  17.48,162.03 0 top
C27  29.46,98.55 270 top
C28  29.46,85.85 270 top
C29  173.86,31.42 270 top
C30  72.39,199.39 270 top
C31  81.84,187.78 270 top
C32  72.39,182.88 270 top
C33  70.1,111.25 270 top
C34  76.35,90.5 90 top
C35  70.1,89.66 270 top
C36  108.2,20.04 90 top
C37  99.19,20.5 270 top
C38  103.73,20.35 270 top
C39  177.16,30.91 90 top
C40  68.88,157.45 0 top
C41  67.06,122.73 0 top
C42  141.27,170.97 180 top
D2  147.32,31.72 180 top
IC1  120.65,48.26 0 top
IC2  130.71,185.65 0 top
IC3  29.21,64.77 180 top
IC4  72.39,191.77 180 top
IC5  70.1,101.6 180 top
JP1  5.04,234.89 90 top
L1  129.54,77.98 90 top
L2  114.3,53.34 0 top
L3  132.08,83.82 270 top
L4  129.54,105.16 90 top
L5  132.08,114.3 270 top
L6  129.29,135.64 90 top
L8  147.88,135.51 0 top
L9  147.85,149.66 0 top
L10  125.73,190.75 0 top
L11  147.85,163.75 0 top
L12  147.88,175.46 0 top
L13  140.2,203.69 90 top
L14  24.43,230.17 270 top
L15  24.21,216.56 270 top
L16  36.68,142.32 180 top
L17  24.16,198.17 270 top
L18  37.08,129.03 180 top
L19  34.54,57.91 180 top
L20  37.08,116.33 180 top
L21  24.18,177.95 270 top
L22  37.08,103.63 180 top
L23  37.08,90.93 180 top
L24  24.41,162.03 270 top
L25  72.36,156.79 270 top
L26  77.47,184.15 180 top
L27  75.44,93.98 180 top
L28  72.34,152.25 270 top
L29  70,128.47 270 top
L30  69.98,123.37 270 top
LED1  160.1,20.29 90 top
MIXER  74.17,43.18 0 top
R1  108.97,54.36 90 top
R2  115.57,61.98 0 top
R3  120.65,63.5 90 top
R4  115.57,65.28 0 top
R5  120.14,190.75 180 top
R6  125.73,198.12 0 top
R7  130.76,200.33 90 top
R8  125.73,201.93 0 top
R9  42.93,57.91 0 top
R10  34.04,50.04 180 top
R11  29.21,48.51 270 top
R12  34.04,46.74 180 top
R13  183.11,17.4 90 top
R14  163.53,22.81 90 top
R15  160.17,14.71 90 top
R16  83.06,184.4 0 top
R17  67.31,179.07 0 top
R18  72.39,177.8 270 top
R19  67.44,176.28 0 top
R20  83.57,93.98 0 top
R21  75.56,81.66 180 top
R22  70.1,80.01 270 top
R23  75.44,78.23 180 top
R24  67.31,208.28 0 top
R25  72.39,206.45 270 top
R26  67.31,204.47 0 top
R27  27.94,238.76 180 top
R28  22.86,237.46 270 top
R29  27.94,235.36 180 top
SAW1  67.69,146.28 270 top
U1  176.28,15.75 180 top
U$1  147.78,236.22 180 top
U$2  [3,2]  4.42,249.58 0 top
U$3  [3,2]  198.68,249.63 0 top
U$4  [3,2]  198.75,4.72 0 top
U$5  [3,2]  4.27,4.62 0 top
U$6  [3,2]  4.27,137.74 0 top
U$7  [3,2]  198.55,123.72 0 top
U$8  [3,2]  79.12,123.77 0 top
U$9  24.89,245.87 0 top
X2  55.88,254 270 top
X3  190.5,254 270 top
X4  175.26,254 270 top
X5  160.52,254 270 top
X6  145.28,254 270 top
X7  130.12,254 270 top
X8  115.14,254 270 top
X9  100.3,254 270 top
X10  85.46,254 270 top
X11  22.86,254 270 top

### Tracks (layer width: path | path; a pad name or v marks a point on that pad's centre or on a via)
GND  (via drill 0.6)
  Top 0.254: 114.3,62.87 R2.1
  other vias: 66.29,192.02 78.41,191.8 137.08,185.8 129.54,212.09 23.72,64.77 60.96,50.8 81.74,72.64 92.41,115.98 162.56,95.25 14.71,223.42 33.93,212.34 63.75,101.57 78.38,101.57 126.34,183.01 35.31,66.7 43.15,238.4
  pour Bottom (isolate 1.016): 0,0 203.2,0 203.2,254 0,254
  pour Top (isolate 1.016): 0,0 203.2,0 203.2,254 0,254
IF_1
  Top 0.61: U$1.P$1 163.06,218.43 190.5,245.87 X3.P
IF_2
  Top 0.61: U$1.P$5 153.15,223.51 175.26,245.62 X4.P
  Top 1.016: 175.24,251.94 X4.P 175.28,251.94
IF_3
  Top 0.61: U$1.P$9 148.33,228.59 160.53,240.79 X5.P
  Top 0.813: X5.P
  Top 1.016: 160.54,251.94 X5.P
IF_4
  Top 0.254: 144.81,251.23 144.98,251.5 X6.P
  Top 0.61: U$1.P$13 145.23,251.24
  Top 0.813: 145.23,251.24 144.98,251.5
  Top 1.016: 145.26,251.84 X6.P
IF_5
  Top 0.61: U$1.P$16 129.99,251.15
  Top 0.813: 129.99,251.15 130.3,251.46 130.3,251.79 X7.P
IF_6
  Top 0.61: U$1.P$12 127.01,228.59 115.06,240.54 115.06,251.89
  Top 0.813: 115.32,251.79 X8.P 115.06,251.89
  Top 1.016: 115.32,252.01 X8.P
IF_7
  Top 0.61: U$1.P$8 121.17,223.51 100.33,244.35 100.33,251.94
  Top 0.813: 100.33,251.94 X9.P
  Top 1.016: X9.P 100.35,251.89
IF_8
  Top 0.254: X10.P 85.37,252.09
  Top 0.61: U$1.P$4 113.04,218.43 85.34,246.13 85.34,251.85
  Top 0.813: 85.34,251.85 X10.P
  Top 1.016: 85.37,252.09 85.43,252.02
IF_BPF_IN
  Top 0.61: 120.65,65.28 120.65,68.86 125.45,73.66 131.09,73.66
  Top 0.813: R4.2 120.65,65.28 R3.2
  Top 1.016: 131.09,73.66 L1.P$1
IF_BPF_OUT
  Top 0.254: 130.81,175.49 C8.1
  Top 0.61: 130.81,175.49 130.81,172.29 132.13,170.97 C42.2
IF_MIXER
  Top 0.61: C1.1 120.65,36.58 119.13,35.05 80.26,35.05 76.71,38.61 MIXER.P$2
IF_OUT
  Top 0.61: L13.2 140.2,208.38 | C15.2 140.2,208.53 | U$1.P$2 140.15,208.43
  Top 0.813: 140.2,208.53 140.2,208.38 140.15,208.43
LO_IN
  Top 0.254: 72.39,204.47 R25.2
  Top 0.61: R25.2 C30.1 | 72.39,204.47 R26.2
LO_MIXER
  Top 0.254: 74.17,78.23 R23.2 | 70.1,78.23 R22.2
  Top 0.61: 74.17,78.23 MIXER.P$6 | R23.2 arc-2 70.1,78.23
LPF_OUT
  Top 0.61: C18.1 29.21,84.7
  Top 0.813: 29.21,84.7 C28.2
N$1
  Top 0.61: C2.1 L1.P$2 L3.P$1
N$2
  Top 0.61: L3.P$2 L4.P$1 | C5.1 129.54,91.44
  Top 0.813: 129.54,91.44 L3.P$2
N$3
  Top 0.61: C6.1 L4.P$2 L5.P$1
  Top 0.813: L5.P$1 132.08,114.81
N$4
  Top 0.61: C7.1 129.54,121.92 L6.P$1
  Top 0.813: 133.1,131.14 L6.P$1 | L5.P$2 129.54,121.92
N$5
  Top 0.61: L6.P$2 C9.1
N$6
  Top 0.61: C10.1 147.85,135.53 | L8.P$1 140.8,135.51
  Top 1.016: 147.85,135.53 L8.P$1 | 140.8,135.51 C9.2
N$7
  Top 0.61: C12.1 147.88,149.68 | L9.P$1 C10.2
  Top 1.016: 147.88,149.68 L9.P$1
N$8
  Top 0.61: C14.1 147.88,163.78 | L11.P$1 147.85,158.02
  Top 1.016: 147.88,163.78 L11.P$1 | 147.85,158.02 C12.2
N$9
  Top 0.61: IC1.1 C1.2
N$10
  Top 0.61: IC1.3 120.65,53.34 | 120.65,53.34 C4.1 | 120.65,53.34 L2.2
N$11
  Top 0.813: C3.2 R1.1 113.35,53.46 L2.1
N$12
  Top 0.61: C4.2 R3.1
  Top 0.813: R3.1 120.65,61.98 R2.2
N$13
  Top 0.61: IC3.1 C18.2
N$14
  Top 0.61: IC2.1 C8.2
N$15
  Top 0.61: IC2.3 130.71,190.75 | 130.71,190.75 C13.1 | L10.2 130.71,190.75
N$16
  Top 0.813: C11.2 123.19,190.83 L10.1 R5.1
N$17
  Top 0.254: 130.76,194.87 130.99,195.43 C13.2 | 130.81,198.12 R7.1
  Top 0.61: R7.1 130.76,194.87
  Top 1.27: 130.81,198.12 R6.2
N$18
  Top 0.61: L13.1 140.2,201.92 139.95,201.68 130.81,201.68
  Top 0.813: 130.56,201.93 R7.2 130.81,201.68
  Top 1.27: R8.2 130.56,201.93
N$19
  Top 0.61: 29.21,57.91 C24.1 | 29.21,57.91 L19.2 | 29.21,57.91 IC3.3
N$20
  Top 0.813: L19.1 38.61,57.91 | 38.61,57.91 R9.1 | C21.2 38.61,57.91
N$21
  Top 0.254: R11.1 29.21,49.99
  Top 0.61: C24.2 29.21,49.99 32.59,49.99
  Top 0.813: 32.59,49.99 R10.2
N$22
  Top 0.61: IC4.1 C30.2
N$23
  Top 0.254: L14.P$2 24.21,222.81
  Top 0.61: 24.21,222.81 L15.P$1 C16.2
N$24
  Top 0.61: 24.16,206.91 L17.P$1 16.95,198.17
  Top 1.016: L15.P$2 24.16,206.91 | 16.95,198.17 C19.2
N$25
  Top 0.61: 24.18,187.63 L21.P$1
  Top 1.016: L17.P$2 24.18,187.63
  Top 1.27: L21.P$1 C23.2
N$26
  Top 0.61: 24.16,168.3 L24.P$1
  Top 1.016: L21.P$2 24.16,168.3
  Top 1.27: L24.P$1 C26.2
N$27  (via drill 0.6)  (1 unrouted)
  Top 0.406: 183.06,18.85 arc-90 R13.2 | 178.76,18.64 178.76,18.67 U1.1 178.49,18.85 | R14.2 163.45,24.21 163.27,24.18 | v163.27,27.28 163.53,27.28
  Top 1.27: U1.1 183.06,18.85 | 163.27,24.18 v163.27,27.28 | 178.49,18.85 178.49,27.08 | v178.49,27.28 178.41,27.28
  Bottom 1.27: v163.27,27.28 v178.49,27.28
N$28
  Top 0.61: C17.2 24.16,147.29 29.08,142.37 | 29.72,141.73 29.72,137.81 | 34.1,142.24 29.21,142.24
  Top 0.813: 29.72,141.73 29.21,142.24 29.08,142.37 | 29.72,137.81 C20.1
  Top 1.016: 34.1,142.24 L16.1
N$29
  Top 0.61: C22.1 29.46,129.03 | 29.46,129.03 C20.2 | L18.1 29.46,129.03
N$30
  Top 0.61: C25.1 29.46,116.33 | 29.46,116.33 C22.2 | L20.1 29.46,116.33
N$31
  Top 0.61: C27.1 29.46,103.63 | 29.46,103.63 C25.2 | L22.1 29.46,103.63
N$32
  Top 0.61: C28.1 29.46,90.93 | 29.46,90.93 C27.2 | L23.1 29.46,90.93
N$33
  Top 0.254: 72.39,184.15 C32.1
  Top 0.61: L26.2 72.39,184.15 IC4.3
N$34
  Top 0.254: 81.92,186.61 82.04,186.97 C31.2 | 81.92,184.15 R16.1
  Top 0.813: 81.92,186.61 81.92,184.15 L26.1
N$35
  Top 0.254: 72.39,179.07 R18.1
  Top 0.61: R18.1 C32.2 | 72.39,179.07 R17.2
N$36
  Top 0.61: IC5.1 C33.2
N$37
  Top 0.254: 70.03,91.03 70,90.88 C35.1
  Top 0.61: IC5.3 70.1,93.98 | 70.1,93.98 C35.1 | L27.2 70.1,93.98
N$38
  Top 0.813: C34.2 76.35,93.97 | 76.35,93.97 L27.1 | 76.35,93.97 81.89,93.97 R20.1
N$39
  Top 0.254: 69.74,81.66 R22.1
  Top 0.61: R22.1 C35.2 | 69.74,81.66 R21.2
N$40
  Top 1.016: 176.02,12.7 176.28,12.7 176.53,12.7
  Top 1.27: 167.13,21.34 167.13,15.49 169.93,12.7 176.02,12.7
N$41
  Top 0.254: R25.1 72.39,208.28
  Top 0.61: 72.39,208.28 R24.2 | X2.P 55.88,224.79 68.58,212.09 68.58,208.41
  Top 1.016: 68.58,208.41 R24.2
N$42
  Top 0.254: 23.11,238.76 R28.1
  Top 0.61: 23.11,238.76 R27.2 | R28.1 22.86,245.87 | 22.86,245.87 X11.P | U$9.P$1 22.86,245.87
N$43
  Top 0.406: LED1.C 160.15,19.07 | 160.15,15.9 160.12,16.11 R15.2
  Top 1.27: 160.15,19.07 160.15,15.9
N$45
  Top 0.61: L25.2 72.36,153.87 L28.1
N$46
  Top 0.61: L29.2 70,124.04 L30.1
N$47
  Top 0.61: L28.2 72.34,147.43 SAW1.P$11
N$48
  Top 0.61: SAW1.P$5 69.99,130.09 L29.1
N$49
  Top 0.61: C42.1 147.86,170.97 | L12.P$1 C14.2
  Top 1.016: 147.86,170.97 C14.2
RF_IN
  Top 0.254: 26.04,235.59 26.04,235.46 R29.2 | 22.45,235.59 R28.2 | 23.09,230.33 23.24,230.33 23.24,230.15 23.5,230.15 23.5,230.07 | L14.P$1 23.09,230.18 22.84,230.84
  Top 0.61: 26.04,235.46 22.84,235.46 22.84,230.84
  Top 0.813: 26.04,235.59 22.45,235.59
  Top 1.016: 22.84,230.84 23.09,230.33
RF_LPF_OUT
  Top 0.61: L24.P$2 C17.1
RF_MIXER  (via drill 0.6)
  Top 0.406: 32.76,47.04 R12.2 32.38,45.87
  Top 0.61: v32.51,39.88 32.51,46.41 | R11.2 32.26,47.11
  Top 0.813: MIXER.P$3 v79.25,39.62 | 32.51,46.41 R12.2 32.26,47.11
  Top 1.016: 32.41,46.31 R12.2 | 79.25,42.67 MIXER.P$3
  Bottom 0.813: v79.25,39.62 79.25,38.61 75.95,35.31 37.08,35.31 v32.51,39.88
RF_VCC  (via drill 0.6)  (1 unrouted)
  Top 0.406: C36.A 99.01,21.39 | 176.28,21.95 v176.28,21.44
  Top 0.813: R1.2 108.97,57.66
  Top 1.016: v142.24,25.4 142.24,21.39 | C38.1 104,21.25 104.14,21.39 | 98.04,184.4 109.47,184.4 115.82,190.75 R5.2 | R16.2 98.04,184.4 | 98.04,184.4 98.04,93.98 | 98.04,93.98 R20.2 | 98.04,93.98 98.04,72.64 108.97,61.72 108.97,57.66 108.71,57.91 104.39,57.91 | R9.2 v51.31,57.91 | v101.85,57.91 104.39,57.91 | 104.39,57.91 v104.39,39.12 | v108.2,26.16 C36.A
  Top 1.27: 99.01,21.39 104.14,21.39 142.24,21.39 LED1.A 163.46,21.34 R14.1 | 163.49,21.44 R14.1 | v176.28,21.44 U1.2 | R14.1 v167.21,21.41
  Bottom 1.016: v167.21,21.41 v176.28,21.44 | D2.A v142.24,25.4 | v51.31,57.91 v101.85,57.91 | v104.39,39.12 104.39,29.97 v108.2,26.16
SAW_IN
  Top 0.254: 72.42,176.22 R18.2
  Top 0.61: C40.2 72.35,157.46 L25.1 72.39,157.47 R18.2 72.27,176.28 R19.2
SAW_OUT
  Top 0.61: C41.2 69.96,122.73 L30.2 | 69.95,122.73 70.05,122.83 70.05,112.48 C33.1
  Top 0.813: C41.2 69.95,122.73
VCC_12V  (via drill 0.6)  (2 unrouted)
  Top 0.406: C39.1 | U1.3 173.89,18.85 173.89,18.8 173.86,18.8
  Top 1.016: v169.42,30.02 C29.A | C29.A C39.1 | 173.86,18.8 C29.A
  Bottom 1.016: JP1.1 5.04,228.26 8.31,225.02 | 8.31,225.02 8.46,224.87 8.53,224.81 8.31,225.02 | 8.31,225.02 8.87,224.51 8.83,151.93 12.62,147.88 12.62,29.21 31.6,10.24 138.07,10.24 152.53,24.69 152.53,31.6 152.45,31.67 | 152.43,31.67 167.77,31.67 v169.42,30.02
  Bottom 1.27: JP1.2 JP1.1

### Text on the board
tSilk: 52 Mhz Low Pass Filter | 120 Mhz High Pass Filter | 125 Mhz SAW Filter | 1.7 Mhz High Pass Filter / BCB Band Rejection | 155 Mhz Low Pass Filter
_tsilk: RF IN | LO IN | IF OUT | Hydra - HF Mixer / by NO1D 2015